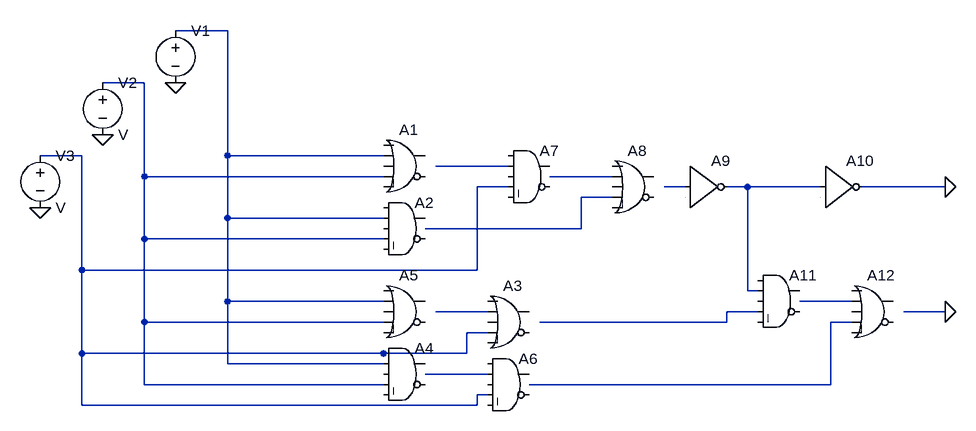
[diagram p0: schematic Draft1.asc]
Draft1.asc, the LTspice schematic file:
Version 4
SHEET 1 1268 680
WIRE 144 -176 64 -176
WIRE 16 -96 -48 -96
WIRE -80 16 -144 16
WIRE 144 16 144 -176
WIRE 384 16 144 16
WIRE 576 32 464 32
WIRE 16 48 16 -96
WIRE 384 48 16 48
WIRE 736 48 640 48
WIRE 576 64 528 64
WIRE 848 64 816 64
WIRE 944 64 912 64
WIRE 1056 64 944 64
WIRE 1248 64 1120 64
WIRE 736 80 688 80
WIRE 144 112 144 16
WIRE 384 112 144 112
WIRE 688 128 688 80
WIRE 688 128 448 128
WIRE 16 144 16 48
WIRE 384 144 16 144
WIRE -80 192 -80 16
WIRE 528 192 528 64
WIRE 528 192 -80 192
WIRE 944 224 944 64
WIRE 960 224 944 224
WIRE 144 240 144 112
WIRE 384 240 144 240
WIRE 1104 240 1024 240
WIRE 544 256 464 256
WIRE 960 256 912 256
WIRE 1248 256 1184 256
WIRE 16 272 16 144
WIRE 384 272 16 272
WIRE 912 272 912 256
WIRE 912 272 624 272
WIRE 1104 272 1072 272
WIRE 544 288 512 288
WIRE -80 320 -80 192
WIRE 512 320 512 288
WIRE 512 320 -80 320
WIRE 144 336 144 240
WIRE 384 336 144 336
WIRE 544 352 448 352
WIRE 16 368 16 272
WIRE 384 368 16 368
WIRE 1072 368 1072 272
WIRE 1072 368 608 368
WIRE 544 384 528 384
WIRE -80 400 -80 320
WIRE 528 400 528 384
WIRE 528 400 -80 400
FLAG 64 -96 0
FLAG -48 -16 0
FLAG -144 96 0
FLAG 1248 256 0
FLAG 1248 64 0
SYMBOL voltage 64 -192 R0
WINDOW 123 0 0 Left 0
WINDOW 39 0 0 Left 0
SYMATTR InstName V1
SYMATTR Value ""
SYMBOL voltage -48 -112 R0
SYMATTR InstName V2
SYMBOL voltage -144 0 R0
SYMATTR InstName V3
SYMBOL Digital\\or 416 -32 R0
WINDOW 0 -8 8 Left 2
SYMATTR InstName A1
SYMATTR Prefix A
SYMATTR SpiceModel OR
SYMATTR Description Behavioral OR gate with complementary outputs
SYMBOL Digital\\and 416 64 R0
WINDOW 0 16 24 Left 2
SYMATTR InstName A2
SYMBOL Digital\\or 576 208 R0
WINDOW 0 -8 8 Left 2
SYMATTR InstName A3
SYMATTR Prefix A
SYMATTR SpiceModel OR
SYMATTR Description Behavioral OR gate with complementary outputs
SYMBOL Digital\\and 416 288 R0
WINDOW 0 16 24 Left 2
SYMATTR InstName A4
SYMBOL Digital\\or 416 192 R0
WINDOW 0 -8 8 Left 2
SYMATTR InstName A5
SYMATTR Prefix A
SYMATTR SpiceModel OR
SYMATTR Description Behavioral OR gate with complementary outputs
SYMBOL Digital\\and 576 304 R0
WINDOW 0 16 24 Left 2
SYMATTR InstName A6
SYMBOL Digital\\and 608 -16 R0
WINDOW 0 16 24 Left 2
SYMATTR InstName A7
SYMBOL Digital\\or 768 0 R0
WINDOW 0 -8 8 Left 2
SYMATTR InstName A8
SYMATTR Prefix A
SYMATTR SpiceModel OR
SYMATTR Description Behavioral OR gate with complementary outputs
SYMBOL Digital\\inv 848 0 R0
SYMATTR InstName A9
SYMBOL Digital\\inv 1056 0 R0
SYMATTR InstName A10
SYMBOL Digital\\and 992 176 R0
WINDOW 0 16 24 Left 2
SYMATTR InstName A11
SYMBOL Digital\\or 1136 192 R0
WINDOW 0 -8 8 Left 2
SYMATTR InstName A12
SYMATTR Prefix A
SYMATTR SpiceModel OR
SYMATTR Description Behavioral OR gate with complementary outputs

The netlist it stands for:
* Draft1.asc
V1 N001 0
V2 N002 0 V
V3 N003 0 V
A1 0 N001 0 N002 0 0 0 0 OR
A2 0 N001 0 N002 0 0 0 0 AND
A3 0 N010 0 N003 0 0 0 0 OR
A4 N003 N001 0 N002 0 0 0 0 AND
A5 0 N001 0 N002 0 0 0 0 OR
A6 0 N013 0 N003 0 0 0 0 AND
A7 0 N004 0 N003 0 0 0 0 AND
A8 0 N005 0 N008 0 0 0 0 OR
A9 N006 0 0 0 0 N007 0 0 BUF
A10 N007 0 0 0 0 0 0 0 BUF
A11 0 N007 0 N011 0 0 0 0 AND
A12 0 N009 0 N012 0 0 0 0 OR
.backanno
.end